# EAGLE design WC (EAGLE 9.6.2)
VERSION: 1.0

## Sheet 1 of 2
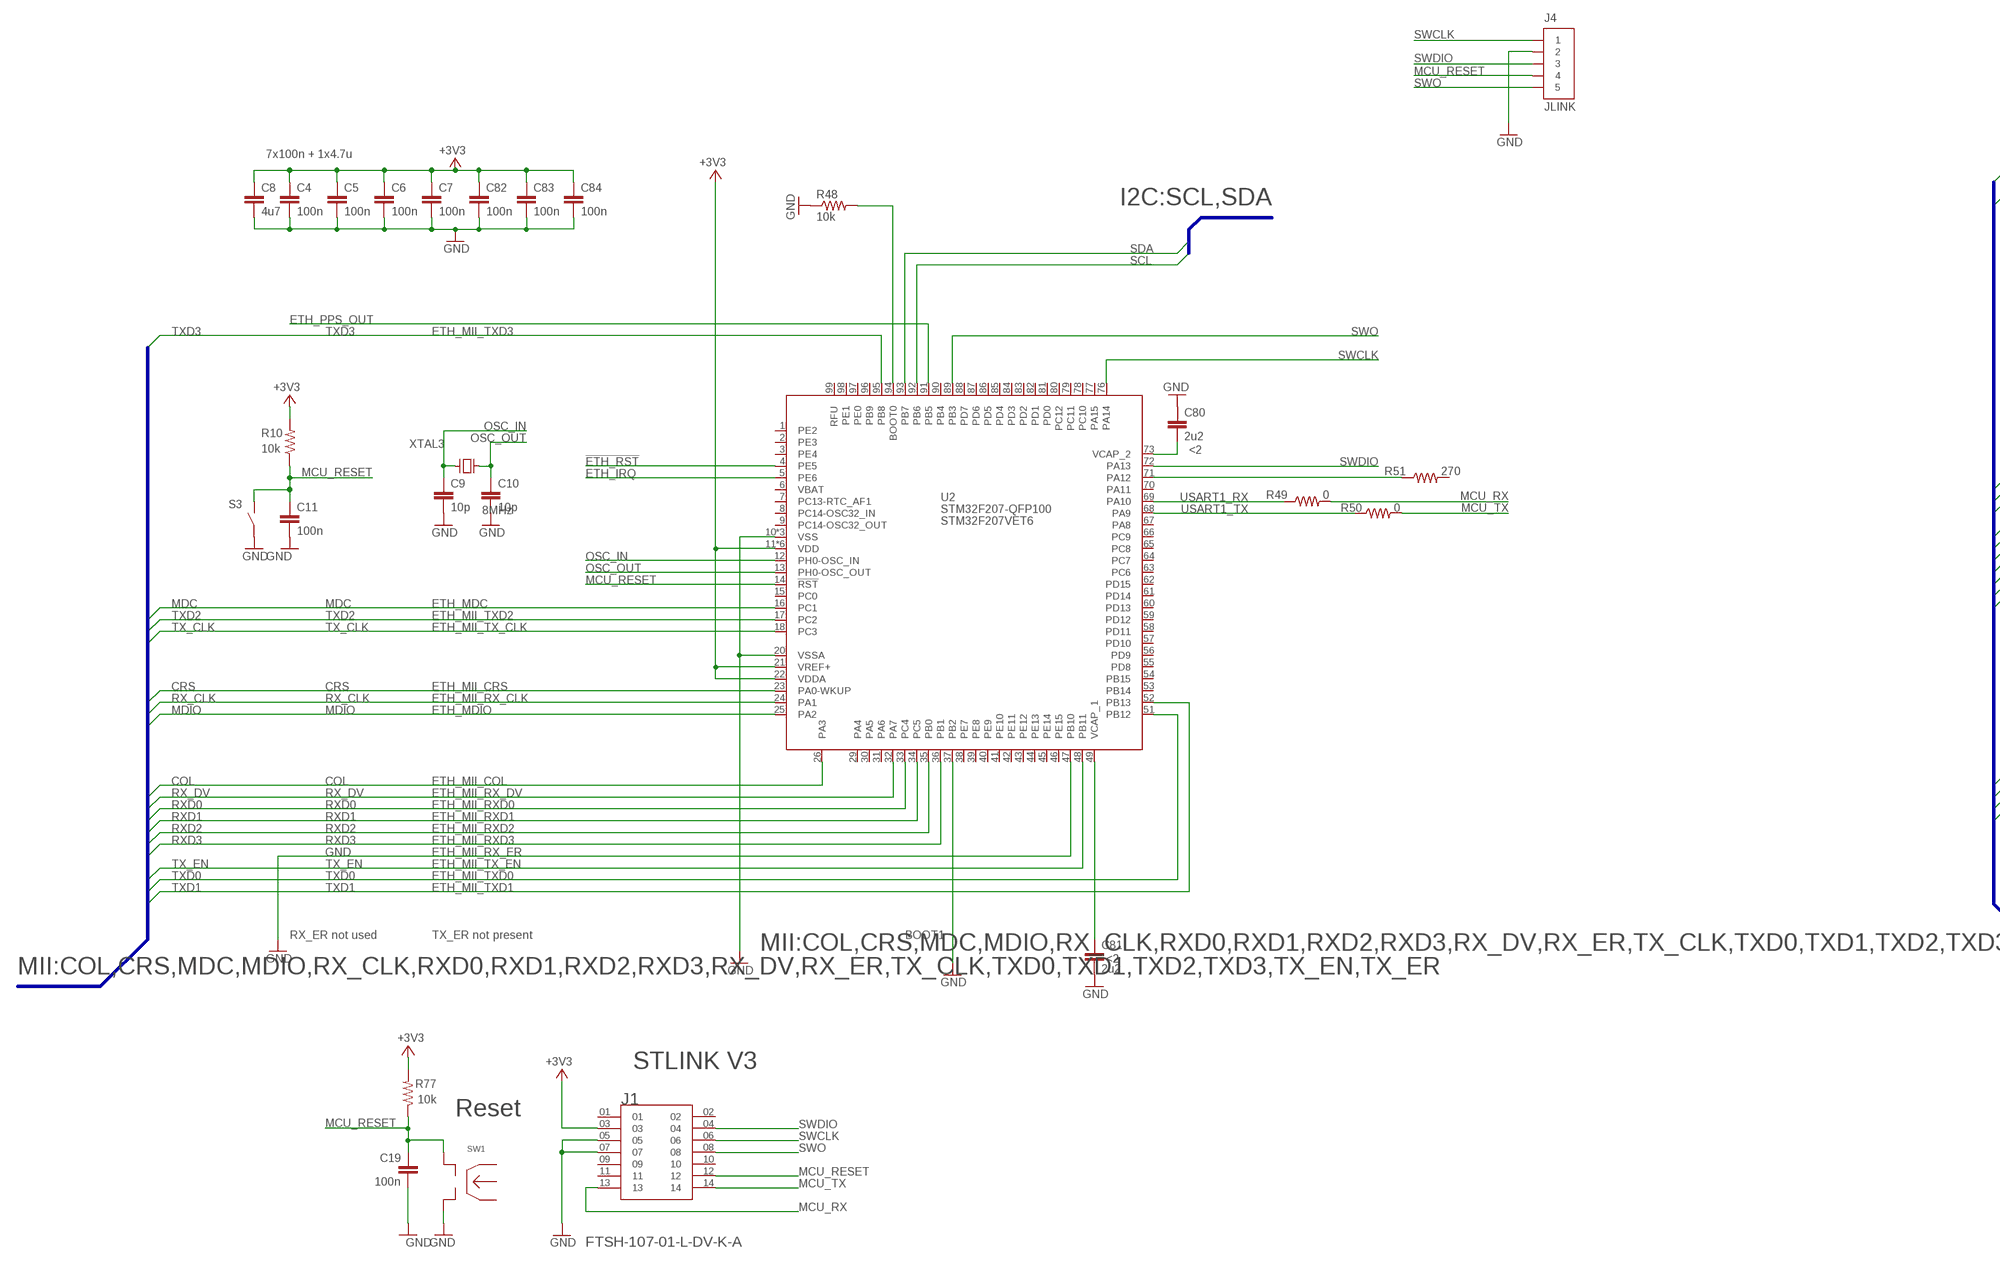
[diagram p0: schematic, sheet 1, part 1 of 2]
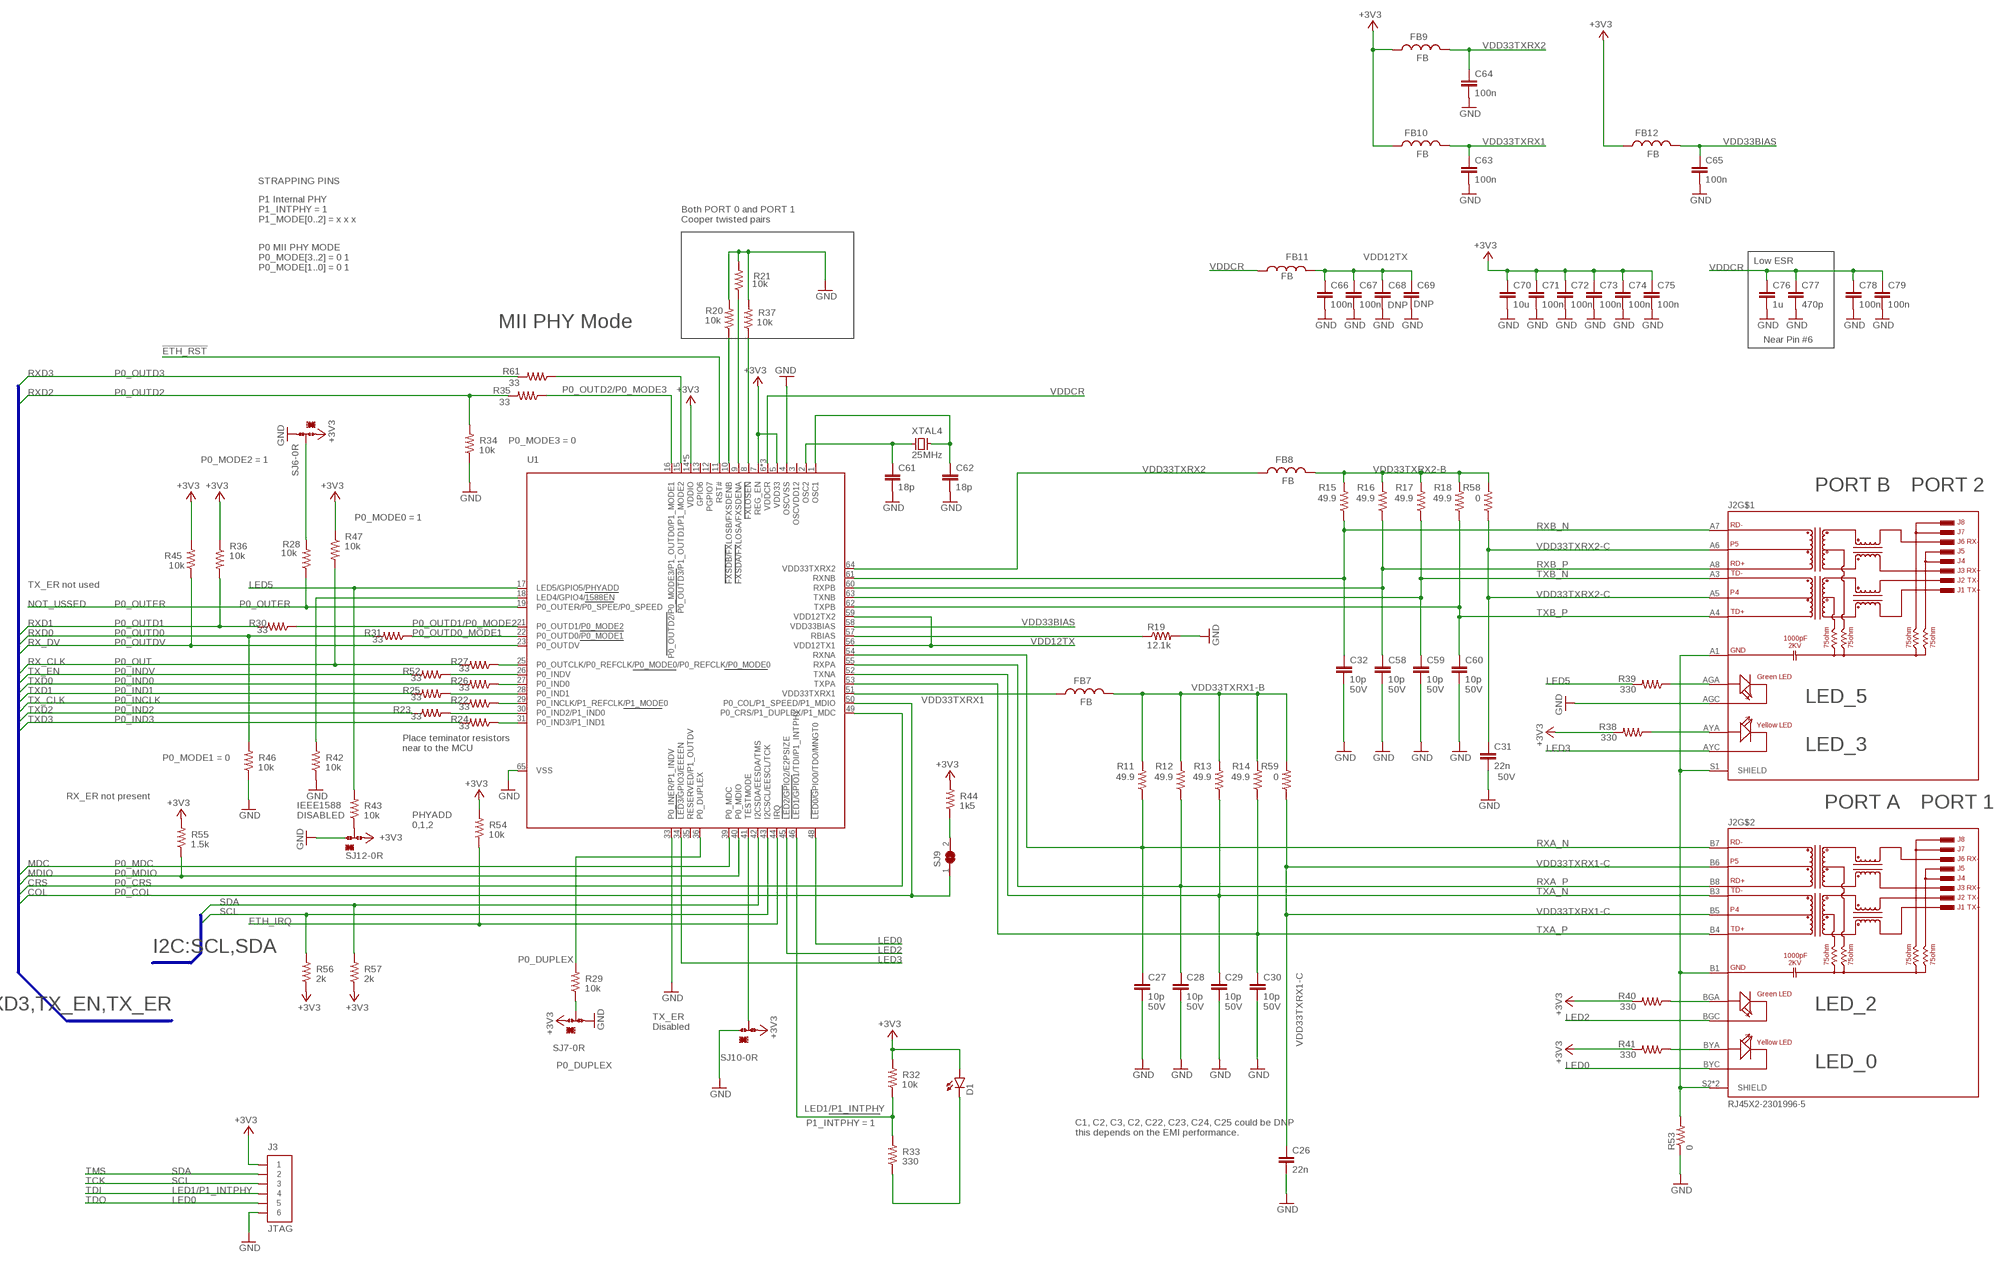
[diagram p1: schematic, sheet 1, part 2 of 2]

### Parts
C4  100n  C_0603  [C_0603]
C5  100n  C_0603  [C_0603]
C6  100n  C_0603  [C_0603]
C7  100n  C_0603  [C_0603]
C8  4u7  C_0805  [C_0805]
C9  10p  C_0603  [C_0603]
C10  10p  C_0603  [C_0603]
C11  100n  C_0603  [C_0603]
C19  100n  C_0603  [C_0603]
C26  22n  C_0805  [C_0805]
C27  10p  C_0402  [C_0402]
C28  10p  C_0402  [C_0402]
C29  10p  C_0402  [C_0402]
C30  10p  C_0402  [C_0402]
C31  22n  C_0805  [C_0805]
C32  10p  C_0402  [C_0402]
C58  10p  C_0402  [C_0402]
C59  10p  C_0402  [C_0402]
C60  10p  C_0402  [C_0402]
C61  18p  C_0603  [C_0603]
C62  18p  C_0603  [C_0603]
C63  100n  C_0603  [C_0603]
C64  100n  C_0603  [C_0603]
C65  100n  C_0603  [C_0603]
C66  100n  C_0603  [C_0603]
C67  100n  C_0603  [C_0603]
C68  100n  C_0603  [C_0603]
C69  100n  C_0603  [C_0603]
C70  10u  C_0603  [C_0603]
C71  100n  C_0603  [C_0603]
C72  100n  C_0603  [C_0603]
C73  100n  C_0603  [C_0603]
C74  100n  C_0603  [C_0603]
C75  100n  C_0603  [C_0603]
C76  1u  C_0603  [C_0603]
C77  470p  C_0603  [C_0603]
C78  100n  C_0603  [C_0603]
C79  100n  C_0603  [C_0603]
C80  2u2  C_0603  [C_0603]
C81  2u2  C_0603  [C_0603]
C82  100n  C_0603  [C_0603]
C83  100n  C_0603  [C_0603]
C84  100n  C_0603  [C_0603]
D1  LED_0603_ARROW  [LED_0603_ARROW]
FB7  FB  L_0603  [L_0603]
FB8  FB  L_0603  [L_0603]
FB9  FB  L_0603  [L_0603]
FB10  FB  L_0603  [L_0603]
FB11  FB  L_0603  [L_0603]
FB12  FB  L_0603  [L_0603]
J1  FTSH-107-01-L-DV-K-A  [SAMTEC_FTSH-107-01-L-DV-K-A]
J2  RJ45X2-2301996-5  [2301996-5]
J3  JTAG  CONVERT-2X3-2.54MM-MALE2.54MM  [CONN-VERT-2.54MM-6PINS-2ROWS]
J4  CONVERT-1X5-2.54MM-MALE_HOLES  [1X05]
R10  10k  R_0603  [R_0603]
R11  49.9  R_0402  [R_0402]
R12  49.9  R_0402  [R_0402]
R13  49.9  R_0402  [R_0402]
R14  49.9  R_0402  [R_0402]
R15  49.9  R_0402  [R_0402]
R16  49.9  R_0402  [R_0402]
R17  49.9  R_0402  [R_0402]
R18  49.9  R_0402  [R_0402]
R19  12.1k  R_0603  [R_0603]
R20  10k  R_0603  [R_0603]
R21  10k  R_0603  [R_0603]
R22  33  R_0603  [R_0603]
R23  33  R_0603  [R_0603]
R24  33  R_0603  [R_0603]
R25  33  R_0603  [R_0603]
R26  33  R_0603  [R_0603]
R27  33  R_0603  [R_0603]
R28  10k  R_0603  [R_0603]
R29  10k  R_0603  [R_0603]
R30  33  R_0603  [R_0603]
R31  33  R_0603  [R_0603]
R32  10k  R_0603  [R_0603]
R33  330  R_0603  [R_0603]
R34  10k  R_0603  [R_0603]
R35  33  R_0603  [R_0603]
R36  10k  R_0603  [R_0603]
R37  10k  R_0603  [R_0603]
R38  330  R_0603  [R_0603]
R39  330  R_0603  [R_0603]
R40  330  R_0603  [R_0603]
R41  330  R_0603  [R_0603]
R42  10k  R_0603  [R_0603]
R43  10k  R_0603  [R_0603]
R44  1k5  R_0603  [R_0603]
R45  10k  R_0603  [R_0603]
R46  10k  R_0603  [R_0603]
R47  10k  R_0603  [R_0603]
R48  10k  R_0603  [R_0603]
R49  0  R_0603  [R_0603]
R50  0  R_0603  [R_0603]
R51  270  R_0603  [R_0603]
R52  33  R_0603  [R_0603]
R53  0  R_1206  [R_1206]
R54  10k  R_0603  [R_0603]
R55  1.5k  R_0603  [R_0603]
R56  2k  R_0603  [R_0603]
R57  2k  R_0603  [R_0603]
R58  0  R_0402  [R_0402]
R59  0  R_0402  [R_0402]
R61  33  R_0603  [R_0603]
R77  10k  R_0603  [R_0603]
S3  TSWITCH_SMTR2  [SMTR2]
SJ6  attributre  0R-JUMPA  [A0R-JMP]
SJ7  0R-JUMPA  [A0R-JMP]
SJ9  SJ  [SJ]
SJ10  0R-JUMPA  [A0R-JMP]
SJ12  0R-JUMPA  [A0R-JMP]
SW1  SWITCH-SCREW  [SCREW-SWITCH]
U1  LAN9353  LAN9353-64QFN  [QFN50P900X900X100-65T600N]
U2  STM32F207-QFP100  [QFP50P1600X1600X160-100N]
XTAL3  8MHz  XTAL3.2X2.5  [XTAL3.2X2.5]
XTAL4  25MHz  XTAL3.2X2.5  [XTAL3.2X2.5]

### Nets
!ETH_RST!: U1.11(RST#) U2.4(PE5)
+3V3: C4.P$1 C5.P$1 C6.P$1 C7.P$1 C8.P$1 C70.P$1 C71.P$1 C72.P$1 C73.P$1 C74.P$1 C75.P$1 C82.P$1 C83.P$1 C84.P$1 D1.A FB9.2 FB10.2 FB12.2 J1.03 J3.1 R10.2 R32.2 R36.1 R38.2 R40.2 R41.2 R44.2 R45.2 R47.1 R54.2 R55.2 R56.1 R57.1 R77.2 SJ6.1 SJ7.1 SJ10.3 SJ12.3 U1.5(VDD33) U1.7(REG_EN) U1.14(VDDIO) U1.20(VDDIO) U1.32(VDDIO) U1.37(VDDIO) U1.47(VDDIO) U2.11(VDD) U2.19(VDD) U2.21(VREF+) U2.22(VDDA) U2.28(VDD) U2.50(VDD) U2.75(VDD) U2.100(VDD) ; also sheet 2
COL [MII]: SJ9.1 U1.50(P0_COL/P1_SPEED/P1_MDIO) U2.26(PA3)
CRS [MII]: U1.49(P0_CRS/P1_DUPLEX/P1_MDC) U2.23(PA0-WKUP)
ETH_IRQ: R54.1 U1.44(IRQ) U2.5(PE6)
ETH_PPS_OUT: U2.91(PB5)
GND: C4.P$2 C5.P$2 C6.P$2 C7.P$2 C8.P$2 C9.P$2 C10.P$2 C11.P$2 C19.P$2 C26.P$2 C27.P$2 C28.P$2 C29.P$2 C30.P$2 C31.P$2 C32.P$2 C58.P$2 C59.P$2 C60.P$2 C61.P$2 C62.P$2 C63.P$2 C64.P$2 C65.P$2 C66.P$2 C67.P$2 C68.P$2 C69.P$2 C70.P$2 C71.P$2 C72.P$2 C73.P$2 C74.P$2 C75.P$2 C76.P$2 C77.P$2 C78.P$2 C79.P$2 C80.P$1 C81.P$2 C82.P$2 C83.P$2 C84.P$2 J1.05 J1.07 J2.AGC(GC) J3.6 J4.2 R19.2 R20.2 R21.2 R34.1 R37.2 R42.1 R46.1 R48.1 R53.1 S3.P$1 S3.P$2 SJ6.3 SJ7.3 SJ10.1 SJ12.1 SW1.2 U1.4(OSCVSS) U1.33(P0_INER/P1_INDV) U1.65(VSS) U2.10(VSS) U2.20(VSSA) U2.27(VSS) U2.37(PB2) U2.47(PB10) U2.74(VSS) ; also sheet 2
LED0: J2.BYC(YC) J3.5 U1.48(LED0/GPIO0/TDO/MNGT0)
LED1/P1_INTPHY: J3.4 R32.1 R33.2 U1.46(LED1/GPIO1/TDI/P1_INTPHY)
LED1_C1: D1.K R33.1
LED2: J2.BGC(GC) U1.45(LED2/GPIO2/E2PSIZE)
LED3: J2.AYC(YC) U1.34(LED3/GPIO3/EEEEN)
LED5: R39.2 R43.2 U1.17(LED5/GPIO5/PHYADD)
MCU_RESET: C11.P$1 C19.P$1 J1.12 J4.4 R10.1 R77.1 S3.P$3 S3.P$4 SW1.1 U2.14(!RST!)
MCU_RX: J1.13 R49.2
MCU_TX: J1.14 R50.2
MDC [MII]: U1.39(P0_MDC) U2.16(PC1)
MDIO [MII]: R55.1 U1.40(P0_MDIO) U2.25(PA2)
N$1: R43.1 SJ12.2
N$4: C80.P$2 U2.73(VCAP_2)
N$8: C81.P$1 U2.49(VCAP_1)
N$9: R48.2 U2.94(BOOT0)
N$11: R51.1 U2.71(PA12)
N$12: C61.P$1 U1.2(OSC2) XTAL4.P$1(X1)
N$13: C62.P$1 U1.1(OSC1) XTAL4.P$3(X2)
N$15: R19.1 U1.57(RBIAS)
N$16: R20.1 U1.10(FXSDB/FXLOSB/FXSDENB)
N$17: R21.1 U1.9(FXSDA/FXLOSA/FXSDENA)
N$18: R22.1 U1.29(P0_INCLK/P1_REFCLK/P1_MODE0)
N$19: R23.1 U1.30(P0_IND2/P1_IND0)
N$20: R24.1 U1.31(P0_IND3/P1_IND1)
N$21: R27.1 U1.25(P0_OUTCLK/P0_REFCLK/P0_MODE0/P0_REFCLK/P0_MODE0)
N$22: R26.1 U1.27(P0_IND0)
N$23: R25.1 U1.28(P0_IND1)
N$24: R28.2 SJ6.2
N$25: R29.1 SJ7.2
N$26: R37.1 U1.8(FXLOSEN)
N$27: J2.AYA(YA) R38.1
N$28: J2.AGA(GA) R39.1
N$29: J2.BGA(GA) R40.1
N$30: J2.BYA(YA) R41.1
N$31: R42.2 U1.18(LED4/GPIO4/1588EN)
N$32: R44.1 SJ9.2
N$33: SJ10.2 U1.41(TESTMODE)
N$36: R52.1 U1.26(P0_INDV)
N$38: R61.1 U1.15(P0_OUTD3/P1_OUTD1/P1_MODE2)
OSC_IN: C9.P$1 U2.12(PH0-OSC_IN) XTAL3.P$3(X2)
OSC_OUT: C10.P$1 U2.13(PH0-OSC_OUT) XTAL3.P$1(X1)
P0_DUPLEX: R29.2 U1.36(P0_DUPLEX)
P0_OUTD0_MODE1: R31.1 U1.22(P0_OUTD0/P0_MODE1)
P0_OUTD1/P0_MODE2: R30.1 U1.21(P0_OUTD1/P0_MODE2)
P0_OUTD2/P0_MODE3: R35.1 U1.16(P0_OUTD2/P0_MODE3/P1_OUTD0/P1_MODE1)
P0_OUTER: R28.1 U1.19(P0_OUTER/P0_SPEE/P0_SPEED)
RX_CLK [MII]: R27.2 R47.2 U2.24(PA1)
RX_DV [MII]: R45.1 U1.23(P0_OUTDV) U2.32(PA7)
RXA_N [dif_ETH]: C27.P$1 J2.B7(RD-) R11.1 U1.54(RXNA)
RXA_P [dif_ETH]: C28.P$1 J2.B8(RD+) R12.1 U1.55(RXPA)
RXB_N [dif_ETH]: C32.P$1 J2.A7(RD-) R15.1 U1.61(RXNB)
RXB_P [dif_ETH]: C58.P$1 J2.A8(RD+) R16.1 U1.60(RXPB)
RXD0 [MII]: R31.2 R46.2 U2.33(PC4)
RXD1 [MII]: R30.2 R36.2 U2.34(PC5)
RXD2 [MII]: R34.2 R35.2 U2.35(PB0)
RXD3 [MII]: R61.2 U2.36(PB1)
SCL: J3.3 R56.2 U1.43(I2CSCL/EESCL/TCK) U2.92(PB6)
SDA: J3.2 R57.2 U1.42(I2CSDA/EESDA/TMS) U2.93(PB7)
SHIELD1: J2.A1(GND) J2.B1(GND) J2.S1(SHIELD) J2.S2(SHIELD) J2.S3(SHIELD) R53.2
SWCLK: J1.06 J4.1 U2.76(PA14)
SWDIO: J1.04 J4.3 U2.72(PA13)
SWO: J1.08 J4.5 U2.89(PB3)
TX_CLK [MII]: R22.2 U2.18(PC3)
TX_EN [MII]: R52.2 U2.48(PB11)
TXA_N [dif_ETH]: C29.P$1 J2.B3(TD-) R13.1 U1.52(TXNA)
TXA_P [dif_ETH]: C30.P$1 J2.B4(TD+) R14.1 U1.53(TXPA)
TXB_N [dif_ETH]: C59.P$1 J2.A3(TD-) R17.1 U1.63(TXNB)
TXB_P [dif_ETH]: C60.P$1 J2.A4(TD+) R18.1 U1.62(TXPB)
TXD0 [MII]: R26.2 U2.51(PB12)
TXD1 [MII]: R25.2 U2.52(PB13)
TXD2 [MII]: R23.2 U2.17(PC2)
TXD3 [MII]: R24.2 U2.95(PB8)
USART1_RX: R49.1 U2.69(PA10)
USART1_TX: R50.1 U2.68(PA9)
VDD12TX: C66.P$1 C67.P$1 C68.P$1 C69.P$1 FB11.2 U1.56(VDD12TX1) U1.59(VDD12TX2)
VDD33BIAS: C65.P$1 FB12.1 U1.58(VDD33BIAS)
VDD33TXRX1: C63.P$1 FB7.2 FB10.1 U1.51(VDD33TXRX1)
VDD33TXRX1-B: FB7.1 R11.2 R12.2 R13.2 R14.2 R59.2
VDD33TXRX1-C: C26.P$1 J2.B5(P4) J2.B6(P5) R59.1
VDD33TXRX2: C64.P$1 FB8.2 FB9.1 U1.64(VDD33TXRX2)
VDD33TXRX2-B: FB8.1 R15.2 R16.2 R17.2 R18.2 R58.2
VDD33TXRX2-C: C31.P$1 J2.A5(P4) J2.A6(P5) R58.1
VDDCR: C76.P$1 C77.P$1 C78.P$1 C79.P$1 FB11.1 U1.6(VDDCR) U1.24(VDDCR) U1.38(VDDCR)
Unconnected: J1.01 J1.02 J1.09 J1.10 J1.11 R51.2 U1.3(OSCVDD12) U1.12(PGPIO7) U1.13(GPIO6) U1.35(RESERVED/P1_OUTDV) U2.1(PE2) U2.2(PE3) U2.3(PE4) U2.6(VBAT) U2.7(PC13-RTC_AF1) U2.8(PC14-OSC32_IN) U2.9(PC14-OSC32_OUT) U2.15(PC0) U2.29(PA4) U2.30(PA5) U2.31(PA6) U2.38(PE7) U2.39(PE8) U2.40(PE9) U2.41(PE10) U2.42(PE11) U2.43(PE12) U2.44(PE13) U2.45(PE14) U2.46(PE15) U2.53(PB14) U2.54(PB15) U2.55(PD8) U2.56(PD9) U2.57(PD10) U2.58(PD11) U2.59(PD12) U2.60(PD13) U2.61(PD14) U2.62(PD15) U2.63(PC6) U2.64(PC7) U2.65(PC8) U2.66(PC9) U2.67(PA8) U2.70(PA11) U2.77(PA15) U2.78(PC10) U2.79(PC11) U2.80(PC12) U2.81(PD0) U2.82(PD1) U2.83(PD2) U2.84(PD3) U2.85(PD4) U2.86(PD5) U2.87(PD6) U2.88(PD7) U2.90(PB4) U2.96(PB9) U2.97(PE0) U2.98(PE1) U2.99(RFU)

### Buses
MII:COL,CRS,MDC,MDIO,RX_CLK,RXD0,RXD1,RXD2,RXD3,RX_DV,RX_ER,TX_CLK,TXD0,TXD1,TXD2,TXD3,TX_EN,TX_ER
I2C:SCL,SDA

### Notes on the sheet
- STRAPPING PINS
- P1 Internal PHY
  P1_INTPHY = 1
  P1_MODE[0..2] = x x x
- Both PORT 0 and PORT 1
  Cooper twisted pairs
- Low ESR
- P0 MII PHY MODE
  P0_MODE[3..2] = 0 1 
  P0_MODE[1..0] = 0 1
- JLINK | MII PHY Mode
- Near Pin #6
- 7x100n + 1x4.7u
- P0_OUTD3
- P0_OUTD2
- P0_MODE3 = 0
- P0_MODE2 = 1
- PORT B | PORT 2
- ETH_MII_TXD3
- P0_MODE0 = 1
- TX_ER not used
- NOT_USSED | P0_OUTER
- P0_OUTD1
- P0_OUTD0
- P0_OUTDV
- P0_OUT
- P0_INDV
- P0_IND0
- P0_IND1
- P0_INCLK | LED_5
- P0_IND2
- P0_IND3
- ETH_MDC
- ETH_MII_TXD2
- ETH_MII_TX_CLK
- Place teminator resistors
  near to the MCU
- LED_3
- P0_MODE1 = 0
- ETH_MII_CRS | RX_ER not present
- ETH_MII_RX_CLK | PORT A | PORT 1
- ETH_MDIO
- IEEE1588
  DISABLED
- PHYADD
  0,1,2
- P0_MDC
- ETH_MII_COL | P0_MDIO
- ETH_MII_RX_DV | P0_CRS
- ETH_MII_RXD0 | P0_COL
- ETH_MII_RXD1
- ETH_MII_RXD2
- ETH_MII_RXD3
- ETH_MII_RX_ER
- ETH_MII_TX_EN
- ETH_MII_TXD0
- ETH_MII_TXD1
- RX_ER not used | TX_ER not present | BOOT1
- LED_2
- TX_ER
  Disabled
- P0_DUPLEX | LED_0
- STLINK V3
- P1_INTPHY = 1
- C1, C2, C3, C2, C22, C23, C24, C25 could be DNP
  this depends on the EMI performance.
- Reset
- TMS
- TCK
- TDI
- TDO

## Sheet 2 of 2: ADC
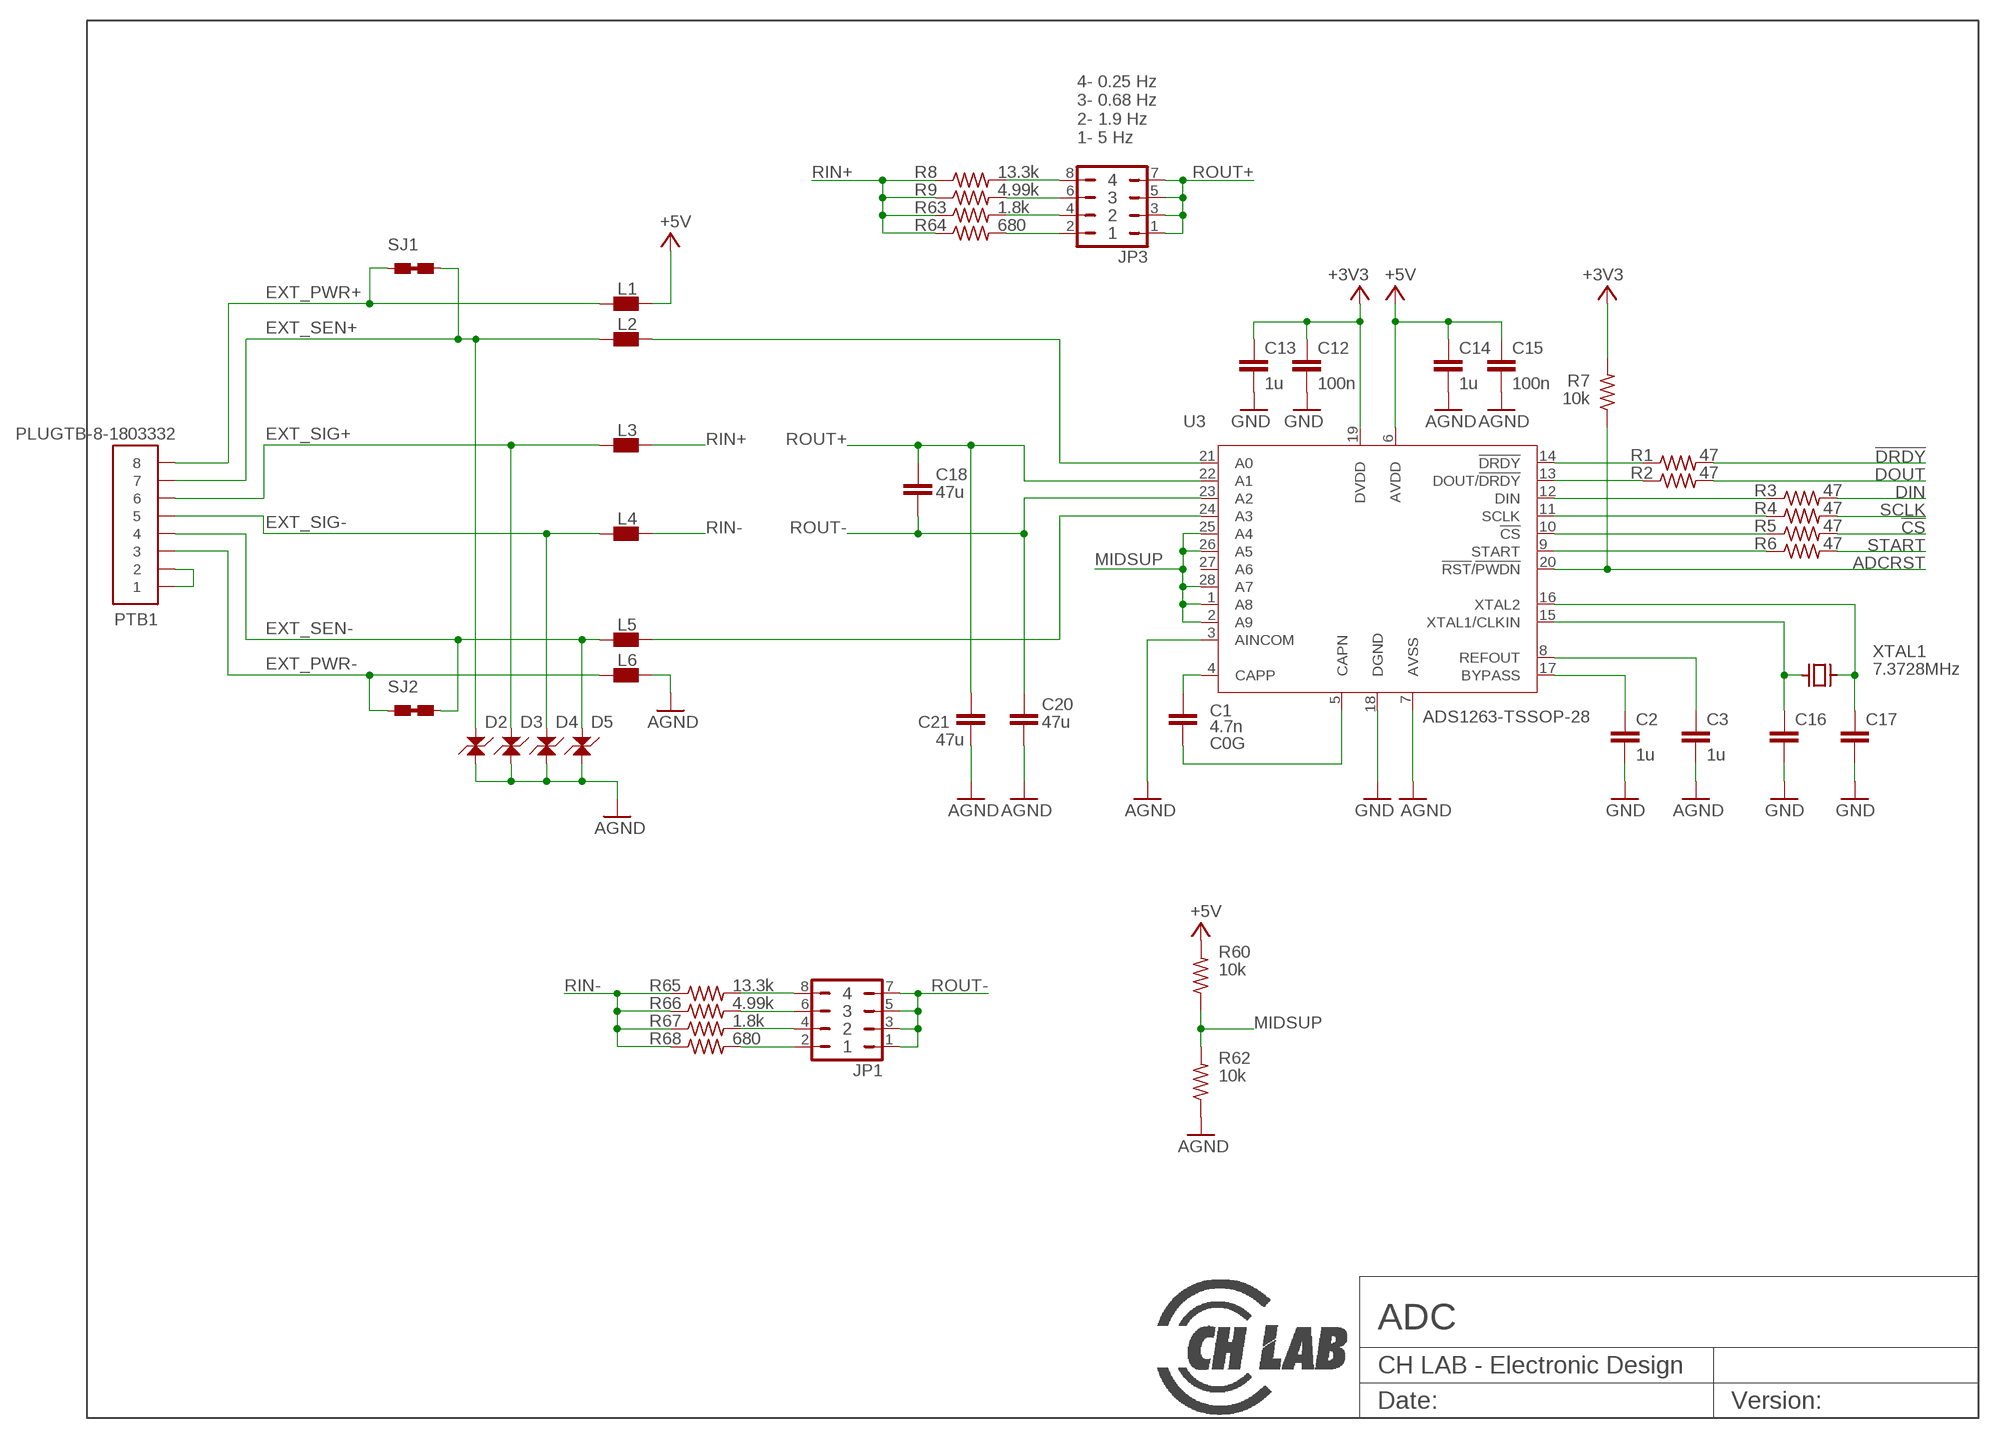
[diagram p2: schematic, sheet 2]

### Parts
C1  4.7n  C_0603  [C_0603]
C2  1u  C_0603  [C_0603]
C3  1u  C_0603  [C_0603]
C12  100n  C_0603  [C_0603]
C13  1u  C_0603  [C_0603]
C14  1u  C_0603  [C_0603]
C15  100n  C_0603  [C_0603]
C16  C_0603  [C_0603]
C17  C_0603  [C_0603]
C18  47u  C_1210  [C_1210]
C20  47u  C_1210  [C_1210]
C21  47u  C_1210  [C_1210]
D2  LESD5D5.0CT1G  [SOD523]
D3  LESD5D5.0CT1G  [SOD523]
D4  LESD5D5.0CT1G  [SOD523]
D5  LESD5D5.0CT1G  [SOD523]
JP1  JP4Q  [JP4Q]
JP3  JP4Q  [JP4Q]
L1  FB_0603  [R_0603]
L2  FB_0603  [R_0603]
L3  FB_0603  [R_0603]
L4  FB_0603  [R_0603]
L5  FB_0603  [R_0603]
L6  FB_0603  [R_0603]
PTB1  PLUGTB-8-1803332  [1803332]
R1  47  R_0402  [R_0402]
R2  47  R_0402  [R_0402]
R3  47  R_0402  [R_0402]
R4  47  R_0402  [R_0402]
R5  47  R_0402  [R_0402]
R6  47  R_0402  [R_0402]
R7  10k  R_0603  [R_0603]
R8  13.3k  R_0603  [R_0603]
R9  4.99k  R_0603  [R_0603]
R60  10k  R_0603  [R_0603]
R62  10k  R_0603  [R_0603]
R63  1.8k  R_0603  [R_0603]
R64  680  R_0603  [R_0603]
R65  13.3k  R_0603  [R_0603]
R66  4.99k  R_0603  [R_0603]
R67  1.8k  R_0603  [R_0603]
R68  680  R_0603  [R_0603]
SJ1  SJUMPER-NC  [SJ1]
SJ2  SJUMPER-NC  [SJ1]
U3  ADS1263-TSSOP-28  [SOP65P640X120-28N]
XTAL1  7.3728MHz  XTAL-SMD-11.44.8  [XTAL]

### Nets
!CS!: R5.2
!DRDY!: R1.2
+3V3: C12.P$1 C13.P$1 R7.2 U3.19(DVDD) ; also sheet 1
+5V: C14.P$1 C15.P$1 L1.2 R60.2 U3.6(AVDD)
ADCRST: R7.1 U3.20(!RST!/!PWDN!)
AGND: C3.P$2 C14.P$2 C15.P$2 C20.P$1 C21.P$1 D2.C D3.C D4.C D5.C L6.2 R62.1 U3.3(AINCOM) U3.7(AVSS)
DIN: R3.2
DOUT: R2.2
EXT_PWR+: L1.1 PTB1.P$8 SJ1.P$1
EXT_PWR-: L6.1 PTB1.P$3 SJ2.P$1
EXT_SEN+: D2.A L2.1 PTB1.P$7 SJ1.P$2
EXT_SEN-: D5.A L5.1 PTB1.P$4 SJ2.P$2
EXT_SIG+: D3.A L3.1 PTB1.P$6
EXT_SIG-: D4.A L4.1 PTB1.P$5
GND: C2.P$2 C12.P$2 C13.P$2 C16.P$2 C17.P$2 U3.18(DGND) ; also sheet 1
MIDSUP: R60.1 R62.2 U3.1(A8) U3.2(A9) U3.25(A4) U3.26(A5) U3.28(A7)
N$2: C1.P$2 U3.5(CAPN)
N$3: C1.P$1 U3.4(CAPP)
N$5: C2.P$1 U3.17(BYPASS)
N$6: C3.P$1 U3.8(REFOUT)
N$7: C17.P$1 U3.16(XTAL2) XTAL1.2(X2)
N$10: R3.1 U3.12(DIN)
N$14: R4.1 U3.11(SCLK)
N$34: R5.1 U3.10(!CS!)
N$35: R6.1 U3.9(START)
N$39: R1.1 U3.14(!DRDY!)
N$40: R2.1 U3.13(DOUT/!DRDY!)
N$41: C16.P$1 U3.15(XTAL1/CLKIN) XTAL1.1(X1)
N$42: L2.2 U3.21(A0)
N$43: JP3.8 R8.2
N$44: JP3.6 R9.2
N$45: JP3.4 R63.2
N$46: JP3.2 R64.2
N$47: L5.2 U3.24(A3)
N$48: JP1.8 R65.2
N$49: JP1.6 R66.2
N$50: JP1.4 R67.2
N$51: JP1.2 R68.2
N$52: PTB1.P$1 PTB1.P$2
RIN+: L3.2 R8.1 R9.1 R63.1 R64.1
RIN-: L4.2 R65.1 R66.1 R67.1 R68.1
ROUT+: C18.P$1 C21.P$2 JP3.1 JP3.3 JP3.5 JP3.7 U3.22(A1)
ROUT-: C18.P$2 C20.P$2 JP1.1 JP1.3 JP1.5 JP1.7 U3.23(A2)
SCLK: R4.2
START: R6.2
Unconnected: U3.27(A6)

### Notes on the sheet
- 4- 0.25 Hz
  3- 0.68 Hz
  2- 1.9 Hz
  1- 5 Hz
- 4
- 3
- 2
- 1
- 4
- 3
- 2
- 1

## Library data of the parts
C1 = Property-standar:C; DK: C0G
C2-C21 C26 C61-C67 C70-C75 C77-C79 C82-C84 = Property-standar:C
C27-C30 C32 C58-C60 = Property-standar:C; V: 50V
C31 = Property-standar:C; VOLTAGE: 50V
C68 C69 = Property-standar:C; DNP: DNP
C76 = Property-standar:C; ERS: LOW
C80 C81 = Property-standar:C; ERS: <2
D1 = Property-standar:LED
D2-D5 = property:LESD5D5.0CT1G
FB7-FB12 = Property-standar:L
J1 = property-connectors:FTSH-107-01-L-DV-K-A: High Reliability Header Strips, 0.050" pitch; MANUFACTURER: Samtec; MAXIMUM_PACKAGE_HEIGHT: 6.23mm; PARTREV: H; STANDARD: Manufacturer Recommendation
J2 = property-connectors:RJ45X2
J3 = property-connectors:CONVERT-2X3-2.54MM-MALE
J4 = property-connectors:CONVERT-1X5-2.54MM-MALE
JP1 JP3 = jumper:JP4Q: JUMPER
L1-L6 = Property-standar:FB
PTB1 = property-connectors:PLUGTB-8; DESC: MC 1,5/ 8-G-3,81; MATING: 1803633
R1-R68 R77 = Property-standar:R
S3 = property:TSWITCH
SJ1 SJ2 = properti-mechanical:SJUMPER-NC
SJ6 SJ7 SJ10 SJ12 = jump-0r-smd:0R-JUMP: SMD 0R 0805 Jumper
SJ9 = jumper:SJ: SMD solder JUMPER
SW1 = property-pads:SWITCH
U1 = property:LAN9353
U2 = property:STM32F207-QFP100; MPN: STM32F207VET6
U3 = property:ADS1263
XTAL1 = property:XTAL-SMD-11.4*4.8; LINK: https://www.mouser.com/ProductDetail/ABRACON/ABLS-7.3728MHZ-K4T?qs=uDmhV2jwPReaiEAs5bxjfg%3D%3D; MPN: ABLS-7.3728MHZ-K4T
XTAL3 = property:XTAL; MPN: 830108313809
XTAL4 = property:XTAL

## Net classes
0 default: width 0.203 mm
1 dif_ETH: width 0.349 mm, clearance 0.508 mm to class 0, clearance 0.508 mm
2 MII: width 0.204 mm, clearance 0.508 mm to class 0, clearance 0.508 mm to class 1, clearance 0.203 mm

## Board
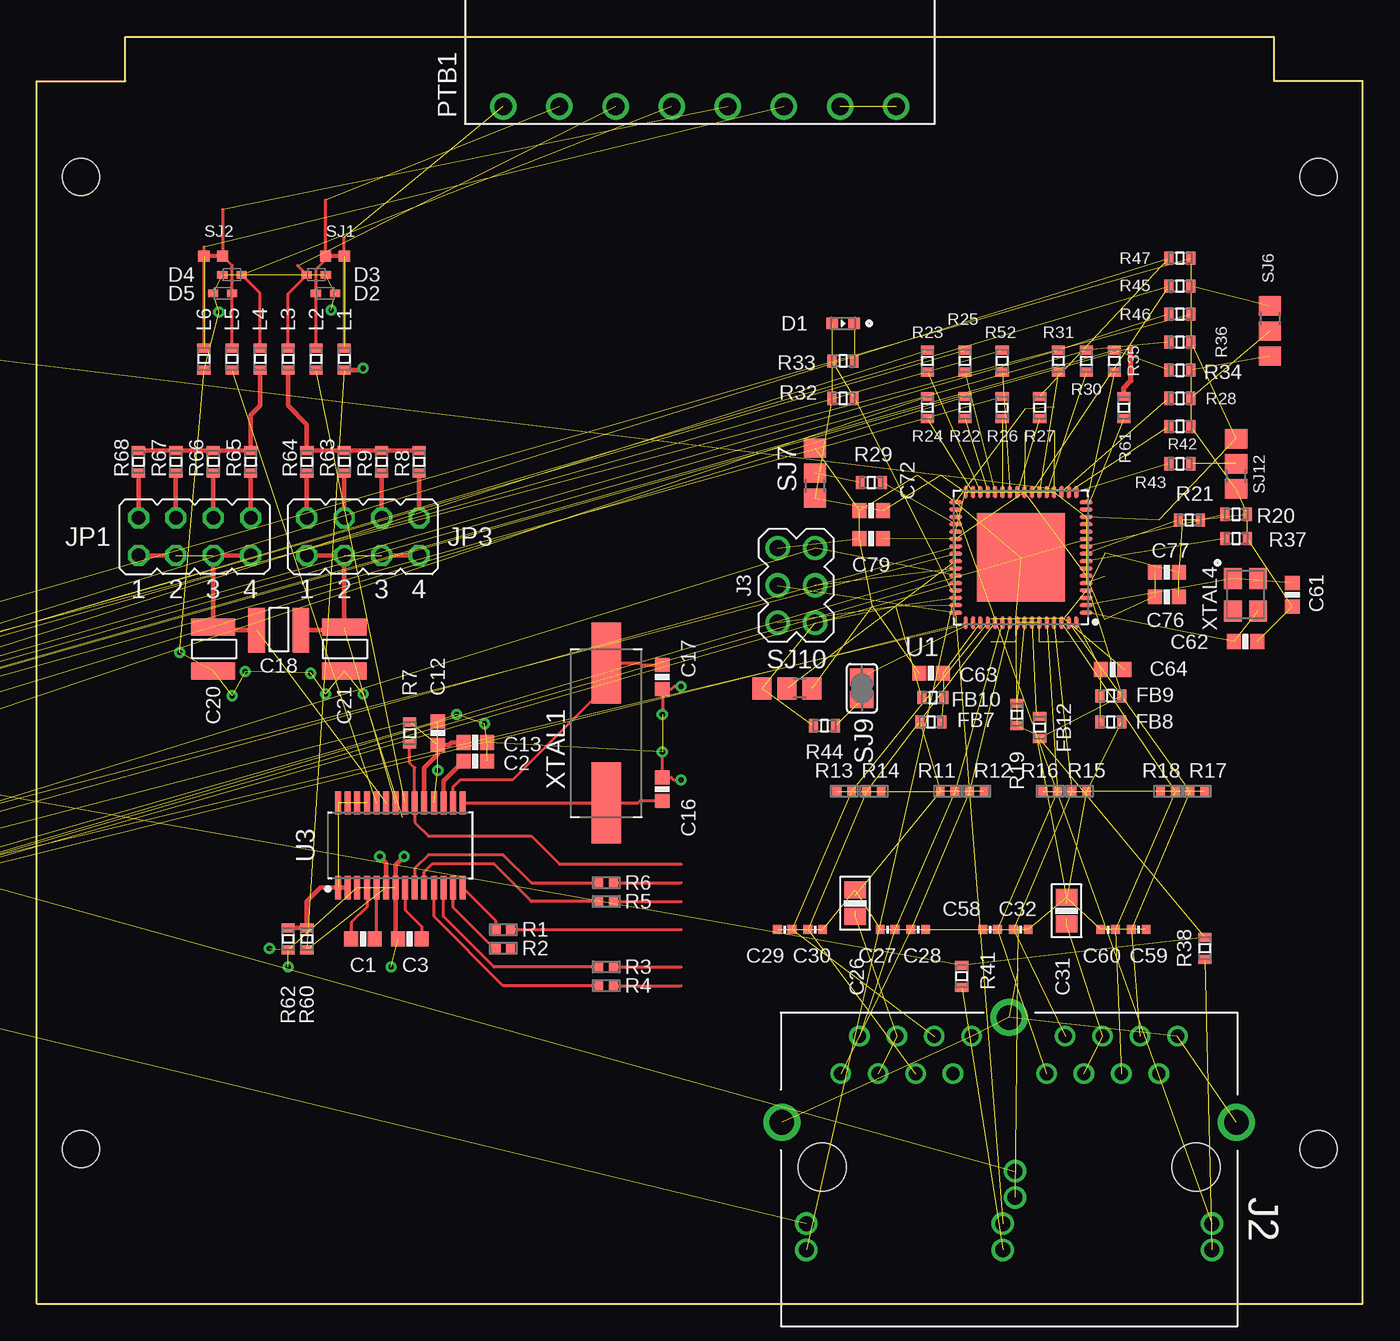
[diagram p3: board, top side]
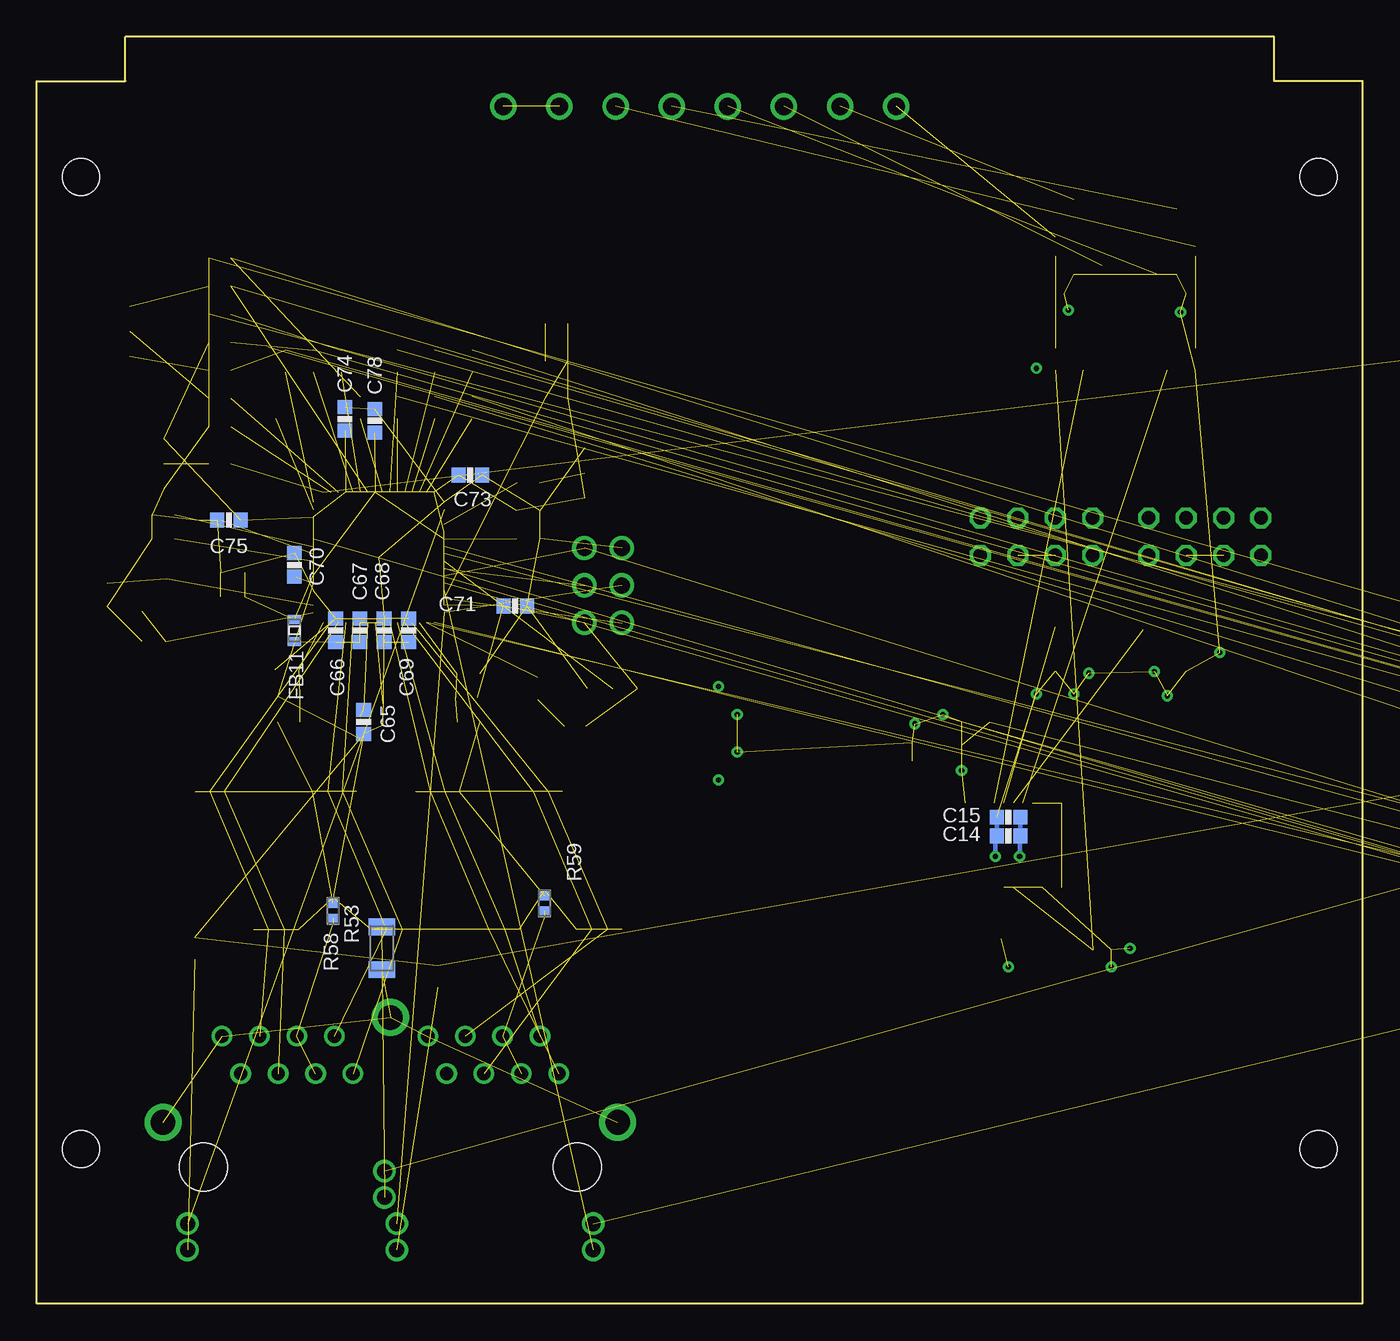
[diagram p4: board, bottom side, seen from below]

Size 90 x 86 mm. Coordinates in mm from the lower left corner, seen from the top.
Outline: 0,0 90,0 90,83 84,83 84,86 6,86 6,83 0,83 0,0
Copper layers (1*16): Top 0.035mm / dielectric 1.5mm / Bottom 0.035mm
Design rules "default": minimum track width 6mil, minimum drill 0.35mm, track to track 6mil, track to pad 6mil, pad to pad 6mil, via to via 6mil, smd to smd 6mil, copper to edge 40mil, drill to drill 6mil, minimum pad ring 10mil, minimum via ring 8mil, stop-mask expansion 4mil, vias tented up to drill 0mil, thermal gap 10mil
Holes 2.5 mm at 3,76.5 87,76.5 3,10.5 87,10.5
tRestrict: area 0.3,7.7 to 5.8,13.2; area 84.3,73.7 to 89.8,79.2; area 84.3,7.7 to 89.8,13.2; area 0.3,73.7 to 5.8,79.2
bRestrict: area 0.3,7.7 to 5.8,13.2; area 84.3,73.7 to 89.8,79.2; area 84.3,7.7 to 89.8,13.2; area 0.3,73.7 to 5.8,79.2
vRestrict: area 0.3,7.7 to 5.8,13.2; area 84.3,73.7 to 89.8,79.2; area 84.3,7.7 to 89.8,13.2; area 0.3,73.7 to 5.8,79.2

### Footprints (pad centres in the part's own frame; a part is rotated, then mirrored left to right if it is on the bottom)
C_0603 = smd 0.95 x 1: P$1 -0.8,0; P$2 0.8,0
C_0805 = smd 1.15 x 1.45: P$1 -0.9,0; P$2 0.9,0
C_1210 = smd 1.15 x 3: P$1 -1.5,0; P$2 1.5,0
C_0402 = smd 0.6 x 0.6: P$1 -0.5,0; P$2 0.5,0
LED_0603_ARROW = smd 0.787 x 0.787: A 0.749,0; K -0.749,0
SOD523 = smd 0.7 x 0.5: A 0.65,0; C -0.65,0
L_0603 = smd 0.61 x 0.889: 1 -0.749,0; 2 0.749,0
SAMTEC_FTSH-107-01-L-DV-K-A = smd 0.74 x 2.79: 01 -3.81,-2.035; 02 -3.81,2.035; 03 -2.54,-2.035; 04 -2.54,2.035; 05 -1.27,-2.035; 06 -1.27,2.035; 07 0,-2.035; 08 0,2.035; 09 1.27,-2.035; 10 1.27,2.035; 11 2.54,-2.035; 12 2.54,2.035; 13 3.81,-2.035; 14 3.81,2.035 | hole 1.02: 3.175,0; -3.175,0
2301996-5 = drill 0.9: A1 11.43,8.89; A2 10.16,6.35; A3 8.89,8.89; A4 7.62,6.35; A5 6.35,8.89; A6 5.08,6.35; A7 3.81,8.89; A8 2.54,6.35; B1 -2.54,8.89; B2 -3.81,6.35; B3 -5.08,8.89; B4 -6.35,6.35; B5 -7.62,8.89; B6 -8.89,6.35; B7 -10.16,8.89; B8 -11.43,6.35 | drill 1.016: AGA 0.406,-0.279; AGC 0.406,-2.057; AYA 13.767,-5.613; AYC 13.767,-3.835; BGA -13.767,-3.835; BGC -13.767,-5.613; BYA -0.432,-5.613; BYC -0.432,-3.835 | drill 1.676: S1 -15.431,3.048; S2 15.431,3.048; S3 0,10.16 | hole 3.251: -12.7,0; 12.7,0
CONN-VERT-2.54MM-6PINS-2ROWS = drill 1.1: 1 -2.54,-1.27; 2 0,-1.27; 3 2.54,-1.27; 4 -2.54,1.27; 5 0,1.27; 6 2.54,1.27
1X05 = drill 1.016 pad 1.88: 1 0,0; 2 2.54,0; 3 5.08,0; 4 7.62,0; 5 10.16,0
JP4Q = drill 0.914 octagon: 1 -3.81,-1.27; 2 -3.81,1.27; 3 -1.27,-1.27; 4 -1.27,1.27; 5 1.27,-1.27; 6 1.27,1.27; 7 3.81,-1.27; 8 3.81,1.27
R_0603 = smd 0.61 x 0.889: 1 -0.749,0; 2 0.749,0
1803332 = drill 1.2: P$1 -13.335,0; P$2 -9.525,0; P$3 -5.715,0; P$4 -1.905,0; P$5 1.905,0; P$6 5.715,0; P$7 9.525,0; P$8 13.335,0
R_0402 = smd 0.6 x 0.6: 1 -0.5,0; 2 0.5,0
R_1206 = smd 1.15 x 1.8: 1 -1.45,0; 2 1.45,0
SMTR2 = smd 1.6 x 1: P$1 -3.2,1.9; P$2 3.2,1.9; P$3 -3.2,-1.9; P$4 3.2,-1.9
SJ1 = smd 0.762 x 0.762: P$1 -0.635,0; P$2 0.635,0
A0R-JMP = smd 1.5 x 1.3: 1 0,1.7; 2 0,0; 3 0,-1.7
SJ = smd 1.168 x 1.6: 1 -0.762,0; 2 0.762,0
SCREW-SWITCH = smd 0.254 x 1.27: 1 -2.146,0; 2 2.146,0
QFN50P900X900X100-65T600N = smd 0.86 x 0.264: 1 -4.435,3.75; 2 -4.435,3.25; 3 -4.435,2.75; 4 -4.435,2.25; 5 -4.435,1.75; 6 -4.435,1.25; 7 -4.435,0.75; 8 -4.435,0.25; 9 -4.435,-0.25; 10 -4.435,-0.75; 11 -4.435,-1.25; 12 -4.435,-1.75; 13 -4.435,-2.25; 14 -4.435,-2.75; 15 -4.435,-3.25; 16 -4.435,-3.75; 33 4.435,-3.75; 34 4.435,-3.25; 35 4.435,-2.75; 36 4.435,-2.25; 37 4.435,-1.75; 38 4.435,-1.25; 39 4.435,-0.75; 40 4.435,-0.25; 41 4.435,0.25; 42 4.435,0.75; 43 4.435,1.25; 44 4.435,1.75; 45 4.435,2.25; 46 4.435,2.75; 47 4.435,3.25; 48 4.435,3.75 | smd 0.264 x 0.86: 17 -3.75,-4.435; 18 -3.25,-4.435; 19 -2.75,-4.435; 20 -2.25,-4.435; 21 -1.75,-4.435; 22 -1.25,-4.435; 23 -0.75,-4.435; 24 -0.25,-4.435; 25 0.25,-4.435; 26 0.75,-4.435; 27 1.25,-4.435; 28 1.75,-4.435; 29 2.25,-4.435; 30 2.75,-4.435; 31 3.25,-4.435; 32 3.75,-4.435; 49 3.75,4.435; 50 3.25,4.435; 51 2.75,4.435; 52 2.25,4.435; 53 1.75,4.435; 54 1.25,4.435; 55 0.75,4.435; 56 0.25,4.435; 57 -0.25,4.435; 58 -0.75,4.435; 59 -1.25,4.435; 60 -1.75,4.435; 61 -2.25,4.435; 62 -2.75,4.435; 63 -3.25,4.435; 64 -3.75,4.435 | smd 6 x 6: 65 0,0
QFP50P1600X1600X160-100N = smd 1.559 x 0.28: 1 -7.678,6; 2 -7.678,5.5; 3 -7.678,5; 4 -7.678,4.5; 5 -7.678,4; 6 -7.678,3.5; 7 -7.678,3; 8 -7.678,2.5; 9 -7.678,2; 10 -7.678,1.5; 11 -7.678,1; 12 -7.678,0.5; 13 -7.678,0; 14 -7.678,-0.5; 15 -7.678,-1; 16 -7.678,-1.5; 17 -7.678,-2; 18 -7.678,-2.5; 19 -7.678,-3; 20 -7.678,-3.5; 21 -7.678,-4; 22 -7.678,-4.5; 23 -7.678,-5; 24 -7.678,-5.5; 25 -7.678,-6; 51 7.678,-6; 52 7.678,-5.5; 53 7.678,-5; 54 7.678,-4.5; 55 7.678,-4; 56 7.678,-3.5; 57 7.678,-3; 58 7.678,-2.5; 59 7.678,-2; 60 7.678,-1.5; 61 7.678,-1; 62 7.678,-0.5; 63 7.678,0; 64 7.678,0.5; 65 7.678,1; 66 7.678,1.5; 67 7.678,2; 68 7.678,2.5; 69 7.678,3; 70 7.678,3.5; 71 7.678,4; 72 7.678,4.5; 73 7.678,5; 74 7.678,5.5; 75 7.678,6 | smd 0.28 x 1.559: 26 -6,-7.678; 27 -5.5,-7.678; 28 -5,-7.678; 29 -4.5,-7.678; 30 -4,-7.678; 31 -3.5,-7.678; 32 -3,-7.678; 33 -2.5,-7.678; 34 -2,-7.678; 35 -1.5,-7.678; 36 -1,-7.678; 37 -0.5,-7.678; 38 0,-7.678; 39 0.5,-7.678; 40 1,-7.678; 41 1.5,-7.678; 42 2,-7.678; 43 2.5,-7.678; 44 3,-7.678; 45 3.5,-7.678; 46 4,-7.678; 47 4.5,-7.678; 48 5,-7.678; 49 5.5,-7.678; 50 6,-7.678; 76 6,7.678; 77 5.5,7.678; 78 5,7.678; 79 4.5,7.678; 80 4,7.678; 81 3.5,7.678; 82 3,7.678; 83 2.5,7.678; 84 2,7.678; 85 1.5,7.678; 86 1,7.678; 87 0.5,7.678; 88 0,7.678; 89 -0.5,7.678; 90 -1,7.678; 91 -1.5,7.678; 92 -2,7.678; 93 -2.5,7.678; 94 -3,7.678; 95 -3.5,7.678; 96 -4,7.678; 97 -4.5,7.678; 98 -5,7.678; 99 -5.5,7.678; 100 -6,7.678
SOP65P640X120-28N = smd 0.407 x 1.572: 1 -4.225,-2.872; 2 -3.575,-2.872; 3 -2.925,-2.872; 4 -2.275,-2.872; 5 -1.625,-2.872; 6 -0.975,-2.872; 7 -0.325,-2.872; 8 0.325,-2.872; 9 0.975,-2.872; 10 1.625,-2.872; 11 2.275,-2.872; 12 2.925,-2.872; 13 3.575,-2.872; 14 4.225,-2.872; 15 4.225,2.872; 16 3.575,2.872; 17 2.925,2.872; 18 2.275,2.872; 19 1.625,2.872; 20 0.975,2.872; 21 0.325,2.872; 22 -0.325,2.872; 23 -0.975,2.872; 24 -1.625,2.872; 25 -2.275,2.872; 26 -2.925,2.872; 27 -3.575,2.872; 28 -4.225,2.872
XTAL = smd 5.5 x 2: 1 -4.75,0; 2 4.75,0
XTAL3.2X2.5 = smd 1.4 x 1.2: P$1 -1.1,-0.85; P$2 1.1,-0.85; P$3 1.1,0.85; P$4 -1.1,0.85

### Placement (x,y rotation side)
C1  22.14,24.77 0 top
C2  29.76,36.83 0 top
C3  25.32,24.77 180 top
C4  -245.19,-40.64 270 top  (outside the outline)
C5  -247.1,-33.66 0 top  (outside the outline)
C6  -252.56,-26.67 0 top  (outside the outline)
C7  -269.32,-45.09 90 top  (outside the outline)
C8  -247.1,-40.64 270 top  (outside the outline)
C9  -242.65,-40.64 270 top  (outside the outline)
C10  -240.75,-37.47 270 top  (outside the outline)
C11  -235.04,-35.56 0 top  (outside the outline)
C12  27.22,38.73 90 top
C13  29.76,38.1 0 top
C14  24.05,31.75 180 bottom
C15  24.05,33.02 180 bottom
C16  42.46,34.92 90 top
C17  42.46,42.55 270 top
C18  16.43,45.72 180 top
C19  -273.13,-57.78 90 top  (outside the outline)
C20  11.98,44.45 90 top
C21  20.87,44.45 90 top
C26  55.54,27.18 90 top
C27  57.75,25.4 180 top
C28  59.83,25.4 0 top
C29  50.77,25.4 180 top
C30  52.85,25.4 0 top
C31  69.89,26.67 90 top
C32  66.79,25.4 0 top
C58  64.71,25.4 180 top
C59  74.79,25.4 0 top
C60  72.71,25.4 180 top
C61  85.22,48.12 270 top
C62  82.04,44.95 0 top
C63  60.7,42.79 180 top
C64  73.02,43.05 0 top
C65  67.82,39.49 270 bottom
C66  69.72,45.71 90 bottom
C67  68.07,45.71 90 bottom
C68  66.42,45.71 90 bottom
C69  64.77,45.71 90 bottom
C70  72.52,50.16 90 bottom
C71  57.53,47.36 0 bottom
C72  56.64,53.84 180 top
C73  60.58,56.25 0 bottom
C74  69.09,60.06 90 bottom
C75  76.96,53.2 180 bottom
C76  76.71,48 0 top
C77  76.71,49.65 0 top
C78  67.05,59.94 90 bottom
C79  56.64,51.94 180 top
C80  -270.6,-45.09 90 top  (outside the outline)
C81  -264.25,-24.77 90 top  (outside the outline)
C82  -265.51,-27.3 90 top  (outside the outline)
C83  -249.77,-45.97 0 top  (outside the outline)
C84  -242.65,-33.02 0 top  (outside the outline)
D1  54.73,66.54 180 top
D2  19.6,68.58 180 top
D3  18.96,69.85 180 top
D4  13.25,69.85 0 top
D5  12.62,68.58 0 top
FB7  60.7,39.49 0 top
FB8  72.9,39.49 180 top
FB9  72.9,41.27 0 top
FB10  60.83,41.14 180 top
FB11  72.52,45.71 270 bottom
FB12  68.07,39.11 270 top
J1  -262.98,-57.78 180 top  (outside the outline)
J2  66,9.27 0 top
J3  51.56,48.76 90 top
J4  -259.42,-50.42 180 top  (outside the outline)
JP1  10.71,52.07 0 top
JP3  22.14,52.07 0 top
L1  20.87,64.14 270 top
L2  18.96,64.14 270 top
L3  17.06,64.14 270 top
L4  15.16,64.14 270 top
L5  13.25,64.14 270 top
L6  11.34,64.14 270 top
PTB1  45,81.28 180 top
R1  31.66,25.4 0 top
R2  31.66,24.13 0 top
R3  38.65,22.86 0 top
R4  38.65,21.59 0 top
R5  38.65,27.3 0 top
R6  38.65,28.57 0 top
R7  25.32,38.73 90 top
R8  25.95,57.15 270 top
R9  23.41,57.15 270 top
R10  -240.5,-44.58 270 top  (outside the outline)
R11  61.82,34.79 180 top
R12  63.8,34.79 0 top
R13  54.81,34.79 180 top
R14  56.82,34.79 0 top
R15  70.76,34.79 0 top
R16  68.78,34.79 180 top
R17  78.76,34.79 0 top
R18  76.78,34.79 180 top
R19  66.52,40 270 top
R20  81.41,53.59 0 top
R21  78.23,53.2 0 top
R22  62.99,60.83 90 top
R23  60.45,64 90 top
R24  60.45,60.83 90 top
R25  62.99,64 90 top
R26  65.53,60.83 90 top
R27  68.07,60.83 90 top
R28  77.59,61.46 0 top
R29  56.64,55.74 0 top
R30  71.25,64 90 top
R31  69.34,64 90 top
R32  54.73,61.46 180 top
R33  54.73,64 180 top
R34  77.59,63.37 180 top
R35  73.15,64 90 top
R36  77.59,65.27 180 top
R37  81.41,51.94 0 top
R38  79.29,24.13 90 top
R39  -222.33,90.17 90 top  (outside the outline)
R40  -242.65,76.83 0 top  (outside the outline)
R41  62.78,22.23 90 top
R42  77.59,59.55 180 top
R43  77.59,57.02 180 top
R44  53.47,39.23 180 top
R45  77.59,69.08 0 top
R46  77.59,67.17 180 top
R47  77.59,70.98 180 top
R48  -254.08,-50.16 90 top  (outside the outline)
R49  -270.6,-40.01 180 top  (outside the outline)
R50  -270.6,-38.73 180 top  (outside the outline)
R51  -226.78,73.03 0 top  (outside the outline)
R52  65.53,64 90 top
R53  66.59,24.13 270 bottom
R54  -243.04,-44.58 270 top  (outside the outline)
R55  -237.96,-28.7 0 top  (outside the outline)
R56  -256.62,-50.16 90 top  (outside the outline)
R57  -255.36,-50.16 90 top  (outside the outline)
R58  69.89,26.67 90 bottom
R59  55.54,27.18 90 bottom
R60  18.33,24.77 270 top
R61  73.78,60.83 90 top
R62  17.06,24.77 90 top
R63  20.87,57.15 270 top
R64  18.33,57.15 270 top
R65  14.52,57.15 270 top
R66  11.98,57.15 270 top
R67  9.44,57.15 270 top
R68  6.9,57.15 270 top
R77  -274.4,-57.78 90 top  (outside the outline)
S3  -236.31,-40.64 270 top  (outside the outline)
SJ1  20.23,71.12 180 top
SJ2  11.98,71.12 0 top
SJ6  83.69,66.03 0 top
SJ7  52.83,56.38 180 top
SJ9  56.01,41.77 270 top
SJ10  50.92,41.77 270 top
SJ12  81.41,57.02 180 top
SW1  -270.6,-57.78 90 top  (outside the outline)
U1  66.8,50.66 180 top
U2  -258.53,-36.83 180 top  (outside the outline)
U3  24.68,31.11 0 top
XTAL1  38.65,38.73 90 top
XTAL3  -243.93,-37.47 180 top  (outside the outline)
XTAL4  82.04,48.12 270 top

### Tracks (layer width: path | path; a pad name or v marks a point on that pad's centre or on a via)
!CS!
  Top 0.203: R5.2 43.73,27.3
!DRDY!
  Top 0.203: R1.2 43.73,25.4
!ETH_RST!  (1 unrouted)
+3V3  (54 unrouted)
  Top 0.305: U3.19 26.3,36.38 27.22,37.3 C12.P$1 27.98,37.94 28.15,38.1 C13.P$1
+5V  (via drill 0.35)  (2 unrouted)
  Top 0.305: U3.6 23.7,29.93 v23.28,30.35 | L1.2 22.03,63.39 v22.14,63.5
  Bottom 0.305: C15.P$1 C14.P$1 23.28,31.71 v23.28,30.35
ADCRST
  Top 0.203: R7.1 25.32,36.72 25.66,36.38 U3.20 25.66,32.68 26.59,31.75 33.57,31.75 35.48,29.84 43.73,29.84
AGND  (via drill 0.35)  (20 unrouted)
  Top 0.203: 24.36,24.93 C3.P$2
  Top 0.305: v24.93,30.35 24.36,29.77 U3.7 24.36,24.93
  Bottom 0.305: C15.P$2 C14.P$2 24.93,31.66 v24.93,30.35
  other vias: 15.79,24.13 17.06,22.86 24.05,22.86 13.25,41.27 14.14,42.93 9.69,44.2 22.14,41.4 18.58,42.8 12.36,67.31 19.98,67.44 19.6,41.4
COL  (2 unrouted)
CRS  (1 unrouted)
DIN
  Top 0.203: R3.2 43.73,22.86
ETH_IRQ  (2 unrouted)
EXT_PWR+  (4 unrouted)
  Top 0.203: L1.1 SJ1.P$1 20.87,72.39
EXT_PWR-  (4 unrouted)
  Top 0.203: L6.1 SJ2.P$1 11.34,71.75
EXT_SEN+  (1 unrouted)
  Top 0.203: 18.95,64.9 L2.1 18.96,68.56 D2.A | D2.A 18.96,68.59 | D2.A 18.95,70.22 19.6,70.87 SJ1.P$2 19.6,74.93
EXT_SEN-  (1 unrouted)
  Top 0.203: L5.1 13.25,68.56 D5.A | D5.A 13.25,68.59 | D5.A 13.27,70.47 SJ2.P$2 12.62,74.3
EXT_SIG+  (1 unrouted)
  Top 0.203: L3.1 17.06,68.58 18.32,69.83 D3.A 17.7,70.47
EXT_SIG-  (1 unrouted)
  Top 0.203: L4.1 15.16,68.59 D4.A 13.89,69.86
GND  (via drill 0.35)  (81 unrouted)
  Top 0.203: v42.46,40.01 C17.P$2 43.09,41.74 43.26,41.91 v43.73,41.91 | v42.46,37.47 C16.P$2 43.06,35.73 43.22,35.56 v43.73,35.56
  other vias: 27.22,36.2 30.39,39.37 28.49,40.01
LED0  (2 unrouted)
LED1/P1_INTPHY  (3 unrouted)
LED1_C1  (1 unrouted)
LED2  (1 unrouted)
LED3  (1 unrouted)
LED5  (2 unrouted)
MCU_RESET  (9 unrouted)
MCU_RX  (1 unrouted)
MCU_TX  (1 unrouted)
MDC  (1 unrouted)
MDIO  (2 unrouted)
MIDSUP  (3 unrouted)
  Top 0.305: U3.2 U3.1 19.27,28.24 18.33,27.3 R60.1 R62.2
N$1  (1 unrouted)
N$2
  Top 0.203: C1.P$2 23.05,24.88 U3.5
N$3
  Top 0.203: U3.4 22.41,26.93 21.34,25.87 C1.P$1
N$4  (1 unrouted)
N$5
  Top 0.305: U3.17 27.61,35.48 C2.P$1
N$6
  Top 0.203: U3.8 25,26.73 26.11,25.62 C3.P$1
N$7
  Top 0.203: U3.16 28.25,35.07 28.74,35.56 32.3,35.56 38.65,41.91 XTAL1.2 40.92,43.48 41.06,43.34 C17.P$1
N$8  (1 unrouted)
N$9  (1 unrouted)
N$10
  Top 0.203: R3.1 31.03,22.86 27.61,26.29 U3.12
N$11  (1 unrouted)
N$12  (2 unrouted)
N$13  (2 unrouted)
N$14
  Top 0.203: R4.1 31.66,21.59 26.95,26.3 U3.11
N$15  (1 unrouted)
N$16  (1 unrouted)
N$17  (1 unrouted)
N$18  (1 unrouted)
N$19  (1 unrouted)
N$20  (1 unrouted)
N$21  (1 unrouted)
N$22  (1 unrouted)
N$23  (1 unrouted)
N$24  (1 unrouted)
N$25  (1 unrouted)
N$26  (1 unrouted)
N$27  (1 unrouted)
N$28  (1 unrouted)
N$29  (1 unrouted)
N$30  (1 unrouted)
N$31  (1 unrouted)
N$32  (1 unrouted)
N$33  (1 unrouted)
N$34
  Top 0.203: R5.1 33.57,27.3 31.03,29.84 26.84,29.84 26.3,29.31 U3.10
N$35
  Top 0.203: R6.1 33.57,28.57 31.66,30.48 26.59,30.48 25.66,29.55 U3.9
N$36  (1 unrouted)
N$38  (1 unrouted)
N$39
  Top 0.203: R1.1 31.16,25.98 U3.14
N$40
  Top 0.203: R2.1 31.03,24.13 28.25,26.91 U3.13
N$41
  Top 0.203: U3.15 XTAL1.1 | XTAL1.1 40.81,33.99 40.95,34.12 C16.P$1 | XTAL1.1
N$42  (1 unrouted)
N$43
  Top 0.305: R8.2 JP3.8
N$44
  Top 0.305: JP3.6 R9.2
N$45
  Top 0.305: R63.2 JP3.4
N$46
  Top 0.305: R64.2 JP3.2
N$47  (1 unrouted)
N$48
  Top 0.305: R65.2 JP1.8
N$49
  Top 0.305: JP1.6 R66.2
N$50
  Top 0.305: R67.2 JP1.4
N$51
  Top 0.305: JP1.2 R68.2
N$52  (1 unrouted)
OSC_IN  (2 unrouted)
OSC_OUT  (2 unrouted)
P0_DUPLEX  (1 unrouted)
P0_OUTD0_MODE1  (1 unrouted)
P0_OUTD1/P0_MODE2  (1 unrouted)
P0_OUTD2/P0_MODE3  (1 unrouted)
P0_OUTER  (1 unrouted)
RIN+
  Top 0.305: L3.2 17.06,60.96 18.33,59.69 R64.1 R63.1 R9.1 R8.1
RIN-
  Top 0.203: R68.1 6.79,57.78
  Top 0.305: L4.2 15.16,60.96 14.52,60.33 R65.1 R66.1 R67.1 R68.1
ROUT+  (2 unrouted)
  Top 0.305: JP3.7 JP3.5 | JP3.1 JP3.3 C21.P$2 20.41,45.72 C18.P$1
ROUT-  (2 unrouted)
  Top 0.305: JP1.1 JP1.3 | JP1.7 JP1.5 C20.P$2 12.58,45.72 C18.P$2
RX_CLK  (2 unrouted)
RX_DV  (2 unrouted)
RXA_N  (3 unrouted)
RXA_P  (3 unrouted)
RXB_N  (3 unrouted)
RXB_P  (3 unrouted)
RXD0  (2 unrouted)
RXD1  (2 unrouted)
RXD2  (2 unrouted)
RXD3  (1 unrouted)
  Top 0.349: R61.2 73.78,62.17 74.28,62.66 74.28,64.91
SCL  (3 unrouted)
SCLK
  Top 0.203: R4.2 43.73,21.59
SDA  (3 unrouted)
SHIELD1  (5 unrouted)
START
  Top 0.203: R6.2 43.73,28.57
SWCLK  (2 unrouted)
SWDIO  (2 unrouted)
SWO  (2 unrouted)
TX_CLK  (1 unrouted)
TX_EN  (1 unrouted)
TXA_N  (3 unrouted)
TXA_P  (3 unrouted)
TXB_N  (3 unrouted)
TXB_P  (3 unrouted)
TXD0  (1 unrouted)
TXD1  (1 unrouted)
TXD2  (1 unrouted)
TXD3  (1 unrouted)
USART1_RX  (1 unrouted)
USART1_TX  (1 unrouted)
VDD12TX  (6 unrouted)
VDD33BIAS  (2 unrouted)
VDD33TXRX1  (3 unrouted)
VDD33TXRX1-B  (5 unrouted)
VDD33TXRX1-C  (3 unrouted)
VDD33TXRX2  (3 unrouted)
VDD33TXRX2-B  (5 unrouted)
VDD33TXRX2-C  (3 unrouted)
VDDCR  (7 unrouted)